# EAGLE design sc300_microstep_piano (EAGLE 7.7.0)

## Sheet 1 of 2
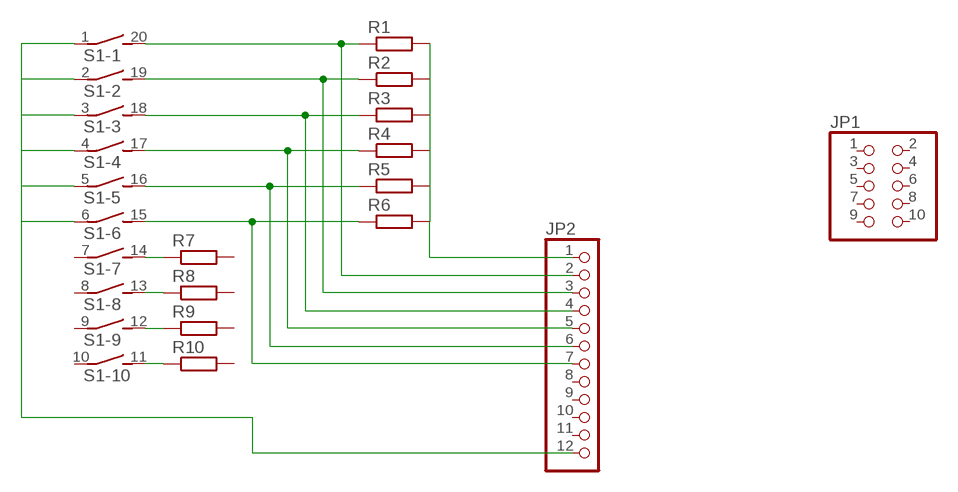
[diagram p0: schematic, sheet 1]

### Parts
JP1  PINHD-2X5  [2X05]
JP2  PINHD-1X12  [1X12]
R1  R-EU_0603  [R0603]
R2  R-EU_0603  [R0603]
R3  R-EU_0603  [R0603]
R4  R-EU_0603  [R0603]
R5  R-EU_0603  [R0603]
R6  R-EU_0603  [R0603]
R7  R-EU_0603  [R0603]
R8  R-EU_0603  [R0603]
R9  R-EU_0603  [R0603]
R10  R-EU_0603  [R0603]
S1  DIP10SB  [DIP10SB]

### Nets
GND_SC: JP2.12 S1.1 S1.2 S1.3 S1.4 S1.5 S1.6
N$1: R7.1 S1.14
N$2: JP2.2 R1.1 S1.20
N$3: R8.1 S1.13
N$4: JP2.3 R2.1 S1.19
N$5: JP2.4 R3.1 S1.18
N$6: JP2.5 R4.1 S1.17
N$8: JP2.6 R5.1 S1.16
N$9: JP2.7 R6.1 S1.15
N$10: R9.1 S1.12
N$11: R10.1 S1.11
N$13: JP2.1 R1.2 R2.2 R3.2 R4.2 R5.2 R6.2
Unconnected: JP1.1 JP1.2 JP1.3 JP1.4 JP1.5 JP1.6 JP1.7 JP1.8 JP1.9 JP1.10 JP2.8 JP2.9 JP2.10 JP2.11 R7.2 R8.2 R9.2 R10.2 S1.7 S1.8 S1.9 S1.10

## Sheet 2 of 2
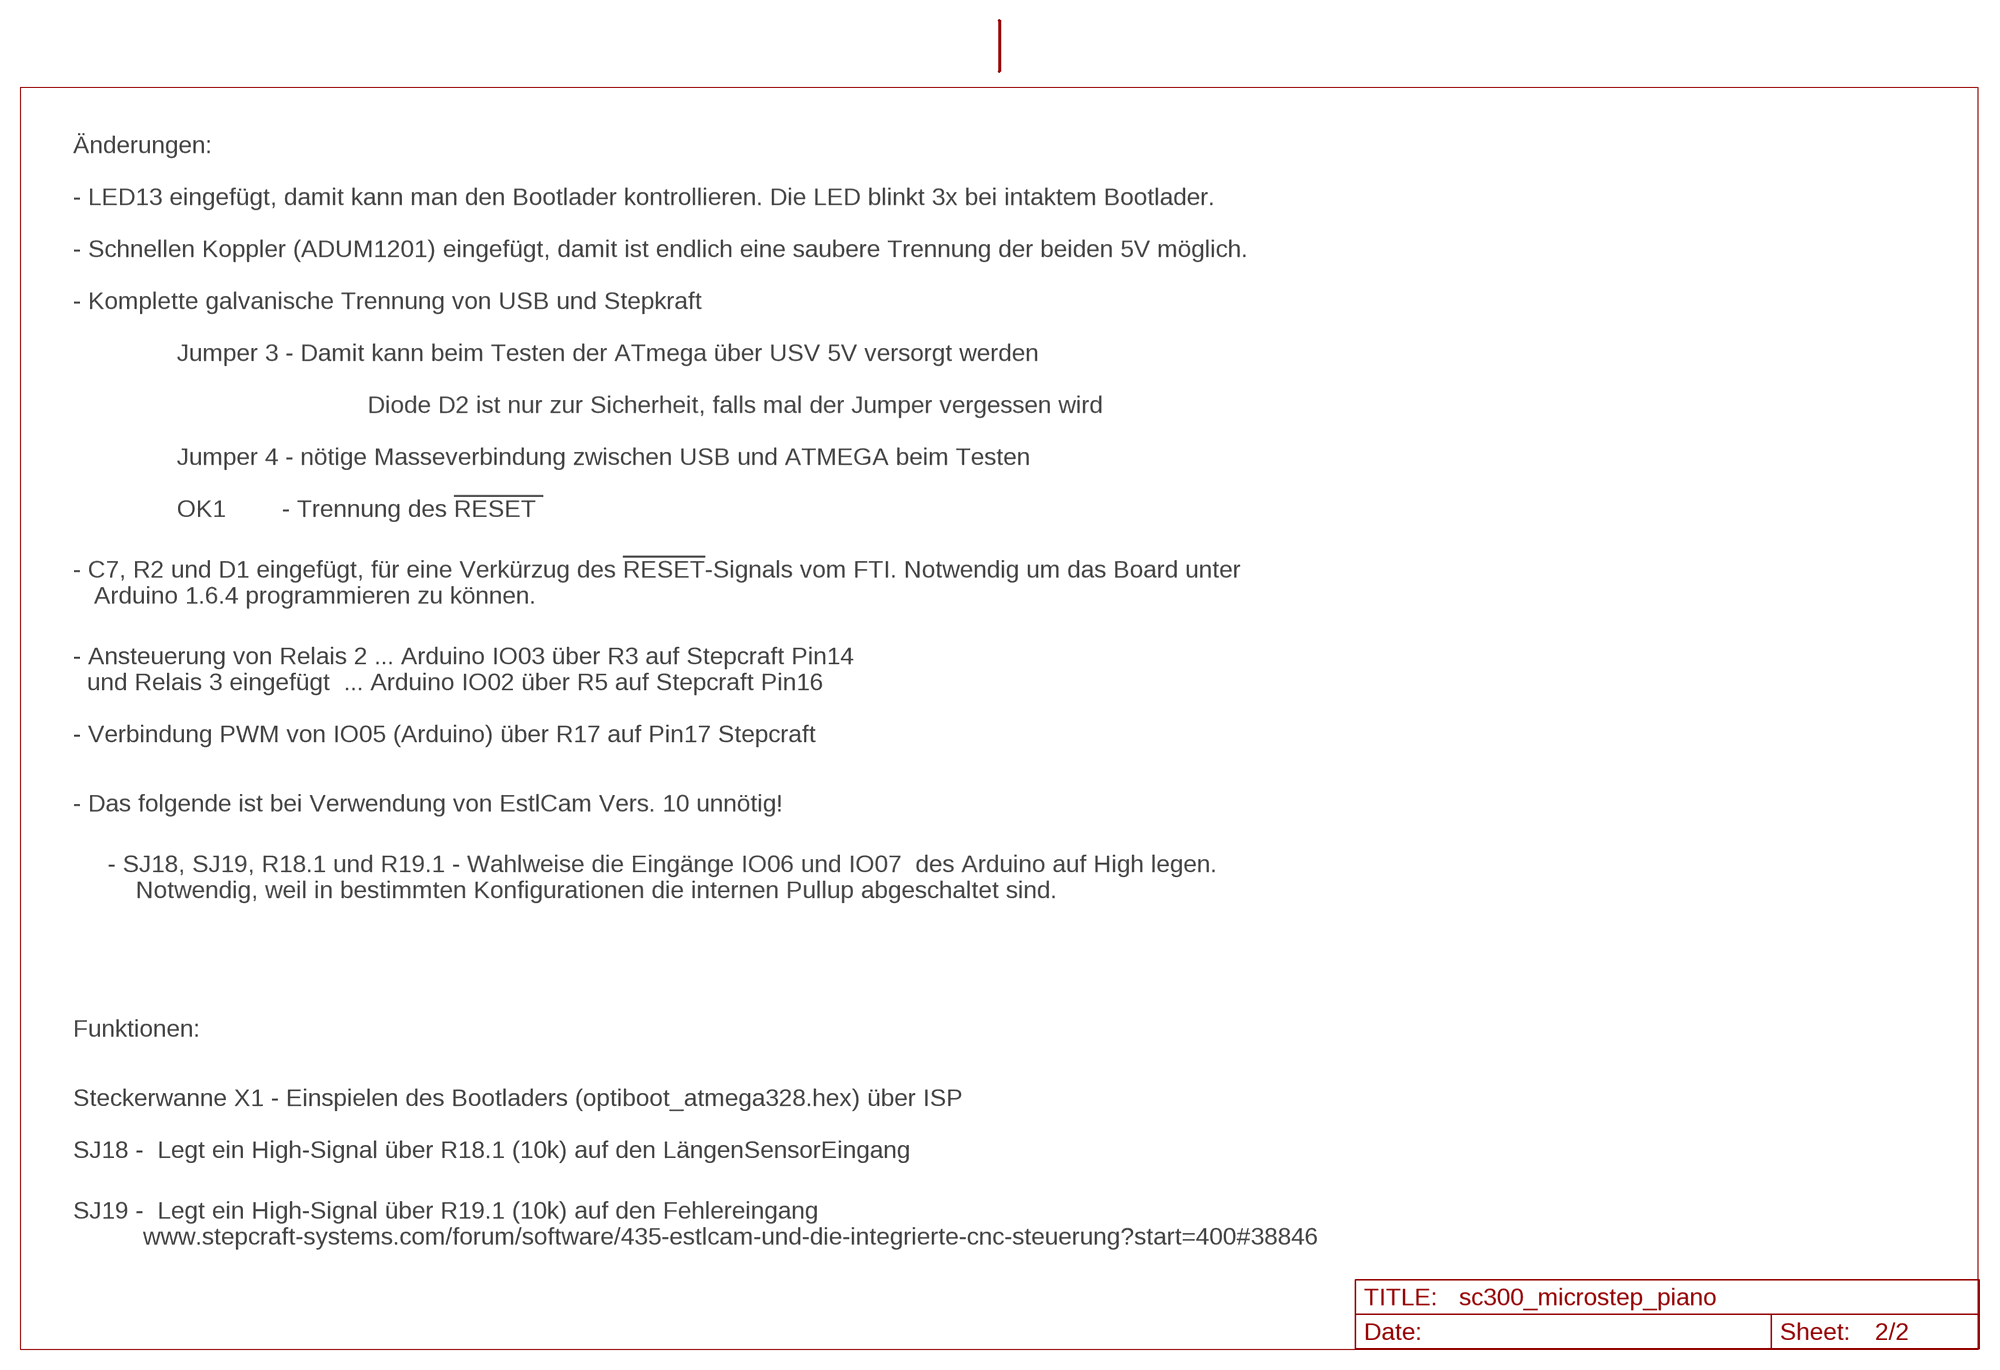
[diagram p1: schematic, sheet 2]

### Notes on the sheet
- Änderungen:
- - LED13 eingefügt, damit kann man den Bootlader kontrollieren. Die LED blinkt 3x bei intaktem Bootlader.
- - Schnellen Koppler (ADUM1201) eingefügt, damit ist endlich eine saubere Trennung der beiden 5V möglich.
- - Komplette galvanische Trennung von USB und Stepkraft
- Jumper 3 - Damit kann beim Testen der ATmega über USV 5V versorgt werden
- Diode D2 ist nur zur Sicherheit, falls mal der Jumper vergessen wird
- Jumper 4 - nötige Masseverbindung zwischen USB und ATMEGA beim Testen
- OK1        - Trennung des !RESET
- - C7, R2 und D1 eingefügt, für eine Verkürzug des !RESET!-Signals vom FTI. Notwendig um das Board unter 
     Arduino 1.6.4 programmieren zu können.
- - Ansteuerung von Relais 2 ... Arduino IO03 über R3 auf Stepcraft Pin14
    und Relais 3 eingefügt  ... Arduino IO02 über R5 auf Stepcraft Pin16
- - Verbindung PWM von IO05 (Arduino) über R17 auf Pin17 Stepcraft
- - Das folgende ist bei Verwendung von EstlCam Vers. 10 unnötig!
- - SJ18, SJ19, R18.1 und R19.1 - Wahlweise die Eingänge IO06 und IO07  des Arduino auf High legen.
      Notwendig, weil in bestimmten Konfigurationen die internen Pullup abgeschaltet sind.
- Funktionen:
- Steckerwanne X1 - Einspielen des Bootladers (optiboot_atmega328.hex) über ISP
- SJ18 -  Legt ein High-Signal über R18.1 (10k) auf den LängenSensorEingang
- SJ19 -  Legt ein High-Signal über R19.1 (10k) auf den Fehlereingang 
            www.stepcraft-systems.com/forum/software/435-estlcam-und-die-integrierte-cnc-steuerung?start=400#38846

## Library data of the parts
JP1 = pinhead:PINHD-2X5: PIN HEADER
JP2 = adafruit:PINHD-1X12: PIN HEADER
R1-R10 = 00vp:R-EU_
S1 = switch-dil:DIP10SB: DIL/CODE SWITCH; OC_FARNELL: unknown; OC_NEWARK: unknown

## Board
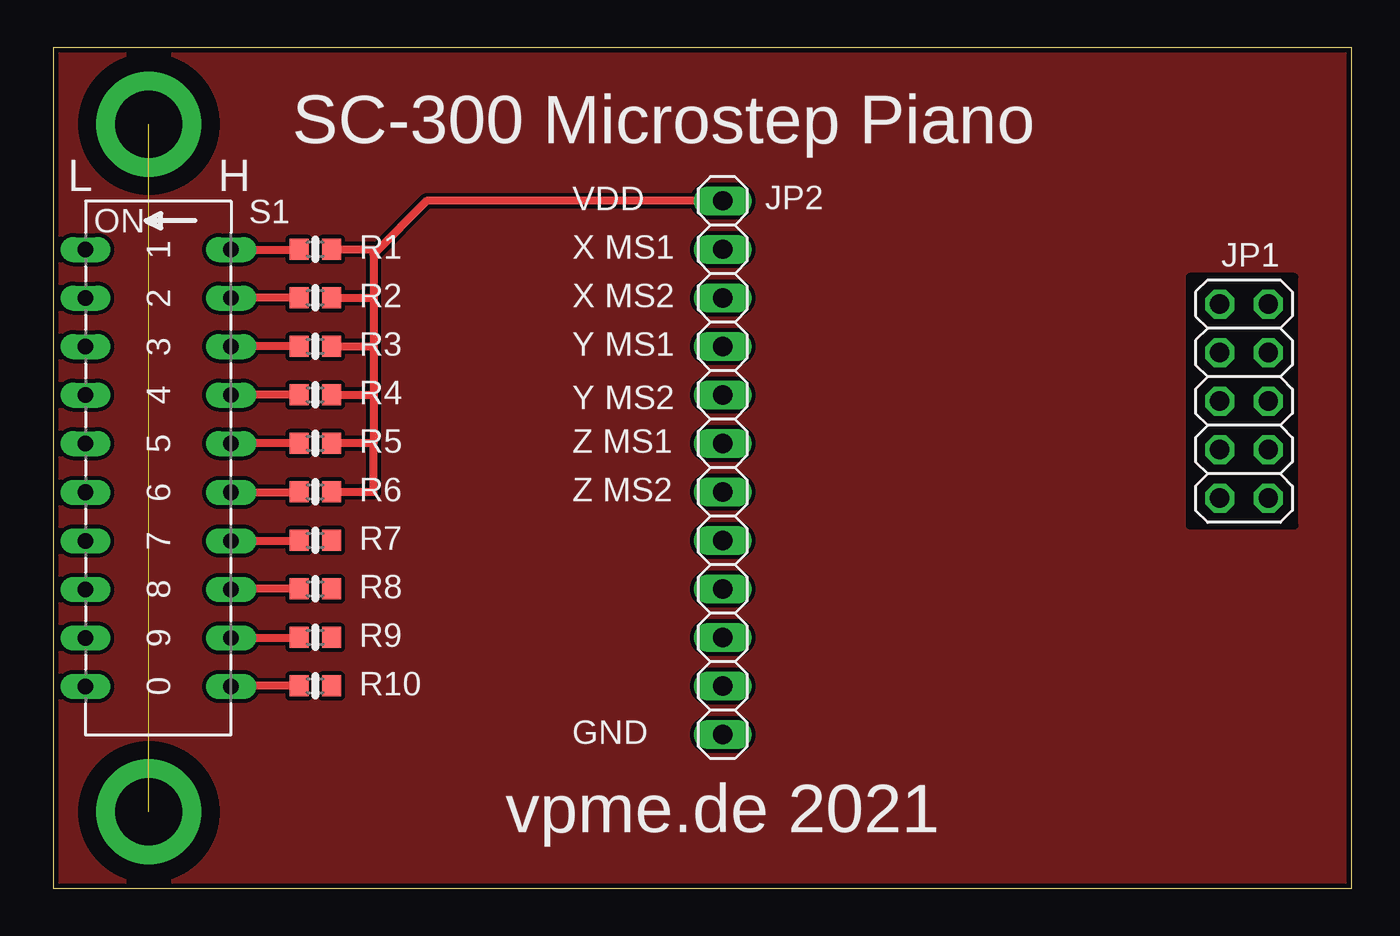
[diagram p2: board, top side]
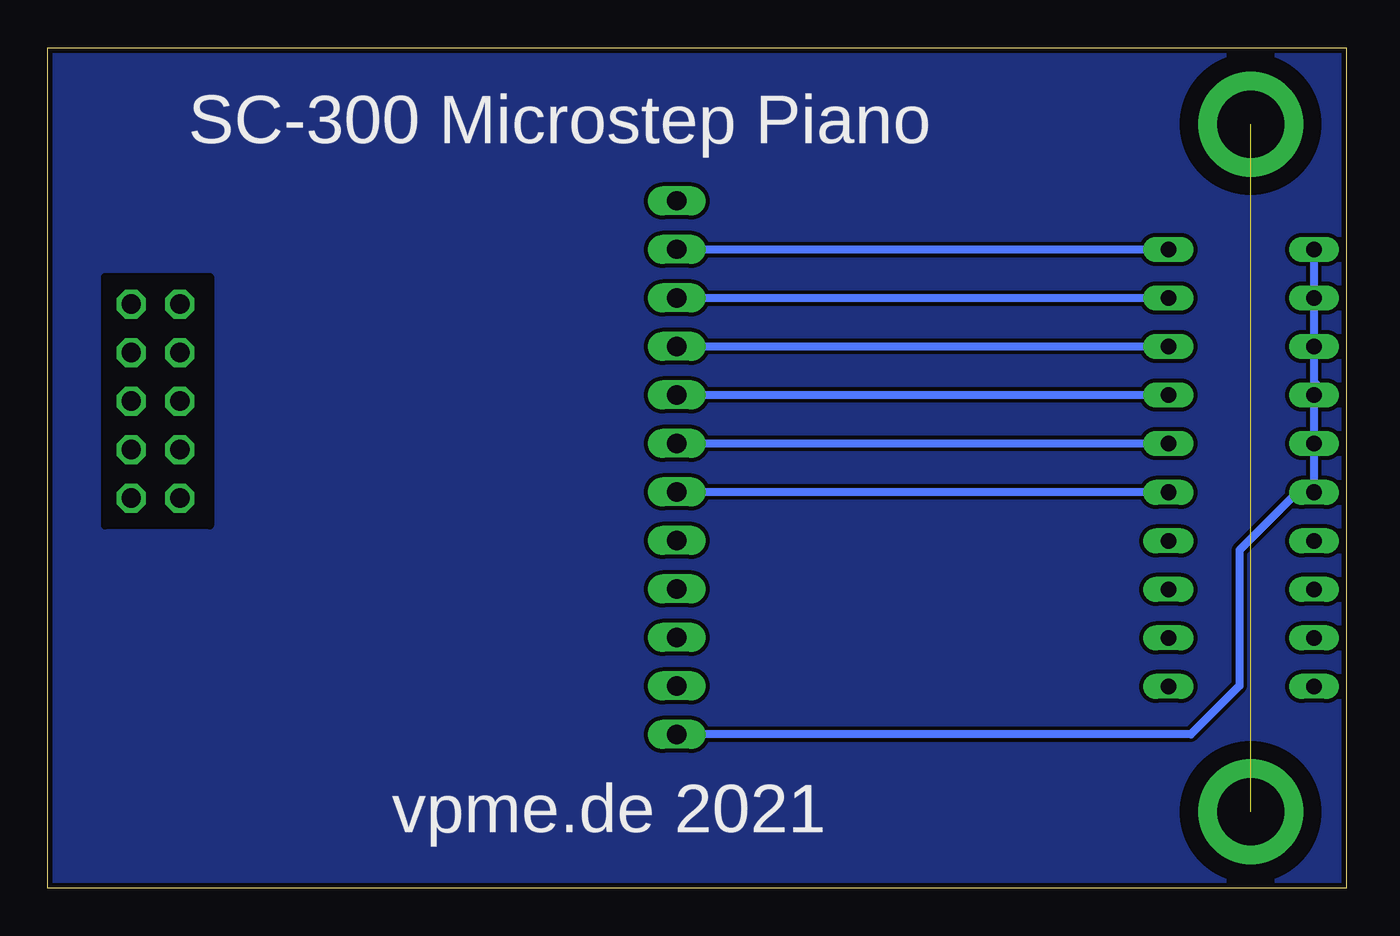
[diagram p3: board, bottom side, seen from below]

Size 68 x 44 mm. Coordinates in mm from the lower left corner, seen from the top.
Outline: 0,0 68,0 68,44 0,44 0,0
Copper layers (1*16): Top 0.035mm / dielectric 1.5mm / Bottom 0.035mm
Design rules "dirt_cheap_dirty_boards.v1": minimum track width 5mil, minimum drill 12mil, track to track 5mil, track to pad 5mil, pad to pad 5mil, via to via 5mil, smd to smd 0mil, copper to edge 10mil, drill to drill 10mil, minimum pad ring 10mil, minimum via ring 6mil, stop-mask expansion 2mil, vias tented up to drill 25mil, thermal gap 10mil
bKeepout: area 59.5,19 to 65,32
tRestrict: area 1.5,36.5 to 8.5,43.5; area 1.5,0.5 to 8.5,7.5; area 59.5,19 to 65,32
bRestrict: area 1.5,36.5 to 8.5,43.5; area 1.5,0.5 to 8.5,7.5; area 59.5,19 to 65,32

### Footprints (pad centres in the part's own frame; a part is rotated, then mirrored left to right if it is on the bottom)
2X05 = drill 1.016 octagon: 1 -5.08,-1.27; 2 -5.08,1.27; 3 -2.54,-1.27; 4 -2.54,1.27; 5 0,-1.27; 6 0,1.27; 7 2.54,-1.27; 8 2.54,1.27; 9 5.08,-1.27; 10 5.08,1.27
1X12 = drill 1.016 long: 1 -13.97,0; 2 -11.43,0; 3 -8.89,0; 4 -6.35,0; 5 -3.81,0; 6 -1.27,0; 7 1.27,0; 8 3.81,0; 9 6.35,0; 10 8.89,0; 11 11.43,0; 12 13.97,0
R0603 = smd 1 x 1.1: 1 -0.85,0; 2 0.85,0
DIP10SB = drill 0.813 long: 1 -11.43,-3.81; 2 -8.89,-3.81; 3 -6.35,-3.81; 4 -3.81,-3.81; 5 -1.27,-3.81; 6 1.27,-3.81; 7 3.81,-3.81; 8 6.35,-3.81; 9 8.89,-3.81; 10 11.43,-3.81; 11 11.43,3.81; 12 8.89,3.81; 13 6.35,3.81; 14 3.81,3.81; 15 1.27,3.81; 16 -1.27,3.81; 17 -3.81,3.81; 18 -6.35,3.81; 19 -8.89,3.81; 20 -11.43,3.81

### Placement (x,y rotation side)
JP1  62.36,25.5 270 top
JP2  35.05,22.02 270 top
R1  13.72,33.45 0 top
R2  13.72,30.91 0 top
R3  13.72,28.37 0 top
R4  13.72,25.83 0 top
R5  13.72,23.29 0 top
R6  13.72,20.75 0 top
R7  13.72,18.21 0 top
R8  13.72,15.67 0 top
R9  13.72,13.13 0 top
R10  13.72,10.59 0 top
S1  5.5,22 270 top

### Tracks (layer width: path | path; a pad name or v marks a point on that pad's centre or on a via)
GND
  pour Top (isolate 0.203, rank 3): 0,0 68,0 68.01,44 0,44
  pour Bottom (isolate 0.203, rank 3): 0,0 68,0 68.01,44 0,44
GND_SC
  Bottom 0.406: S1.1 S1.2 S1.3 1.69,26.5 1.27,26.08 1.42,26.08 S1.4 S1.5 S1.6 2.56,20.73 5.59,17.7 5.59,10.59 8.13,8.05 JP2.12
N$1
  Top 0.406: S1.14 12.85,18.19 R7.1
N$2
  Top 0.406: S1.20 12.85,33.43 R1.1
  Bottom 0.406: S1.20 35.03,33.43 JP2.2
N$3
  Top 0.406: R8.1 9.33,15.67 S1.13
N$4
  Top 0.406: R2.1 9.33,30.91 S1.19
  Bottom 0.406: S1.19 35.03,30.89 JP2.3
N$5
  Top 0.406: R3.1 9.33,28.37 S1.18
  Bottom 0.406: JP2.4 9.33,28.37 S1.18
N$6
  Top 0.406: R4.1 9.33,25.83 S1.17
  Bottom 0.406: JP2.5 9.33,25.83 S1.17
N$7  (via drill 3.5 pad 5.5)  (1 unrouted)
  other vias: 5,40 5,4
N$8
  Top 0.406: R5.1 9.33,23.29 S1.16
  Bottom 0.406: JP2.6 9.33,23.29 S1.16
N$9
  Top 0.406: S1.15 12.85,20.73 R6.1
  Bottom 0.406: JP2.7 9.33,20.75 S1.15
N$10
  Top 0.406: S1.12 12.85,13.11 R9.1
N$11
  Top 0.406: R10.1 9.33,10.59 S1.11
N$13
  Top 0.406: R6.2 16.76,20.75 16.76,23.29 | 16.76,23.29 R5.2 | R1.2 16.76,33.45 16.76,33.2 | 16.76,33.2 16.76,30.91 | 16.76,30.91 16.76,28.37 | 16.76,28.37 16.76,25.83 | 16.76,25.83 16.76,23.29 | R2.2 16.76,30.91 | R3.2 16.76,28.37 | R4.2 16.76,25.83 | JP2.1 19.56,35.99 16.76,33.2

### Text on the board
tPlace: SC-300 Microstep Piano | L | H | VDD | X MS1 | X MS2 | Y MS1 | Y MS2 | Z MS1 | Z MS2 | GND | vpme.de 2021
bPlace: SC-300 Microstep Piano | vpme.de 2021